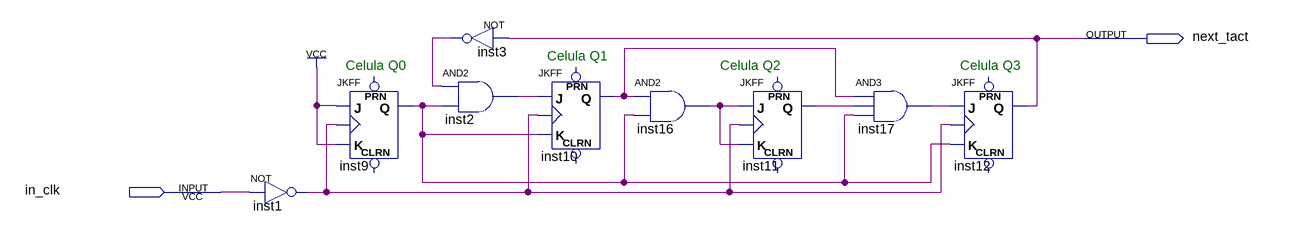
[diagram p0: schematic sheet]
// Quartus schematic divizor_10.bdf as structural Verilog: 9 symbols, 2 pins
module divizor_10 (
  input  in_clk,
  output next_tact
);

  wire inst1_out, inst2_out, inst3_out, inst9_q, inst10_q, inst11_q, inst16_out, inst17_out;

  not inst1 (inst1_out, in_clk);
  JKFF inst9 (.K(1'b1), .J(1'b1), .CLK(inst1_out), .Q(inst9_q));  // open: PRN, CLRN
  not inst3 (inst3_out, next_tact);
  and inst2 (inst2_out, inst3_out, inst9_q);
  JKFF inst10 (.K(inst9_q), .J(inst2_out), .CLK(inst1_out), .Q(inst10_q));  // open: PRN, CLRN
  and inst16 (inst16_out, inst10_q, inst9_q);
  JKFF inst11 (.K(inst16_out), .J(inst16_out), .CLK(inst1_out), .Q(inst11_q));  // open: PRN, CLRN
  and inst17 (inst17_out, inst10_q, inst11_q, inst9_q);
  JKFF inst12 (.K(inst9_q), .J(inst17_out), .CLK(inst1_out), .Q(next_tact));  // open: PRN, CLRN

  // Notes on the sheet:
  //   Celula Q1
  //   Celula Q0
  //   Celula Q2
  //   Celula Q3
endmodule
